# Altium schematic sheet Power Distribution.SchDoc
size A4; SheetNumber: 3; SheetTotal: 6
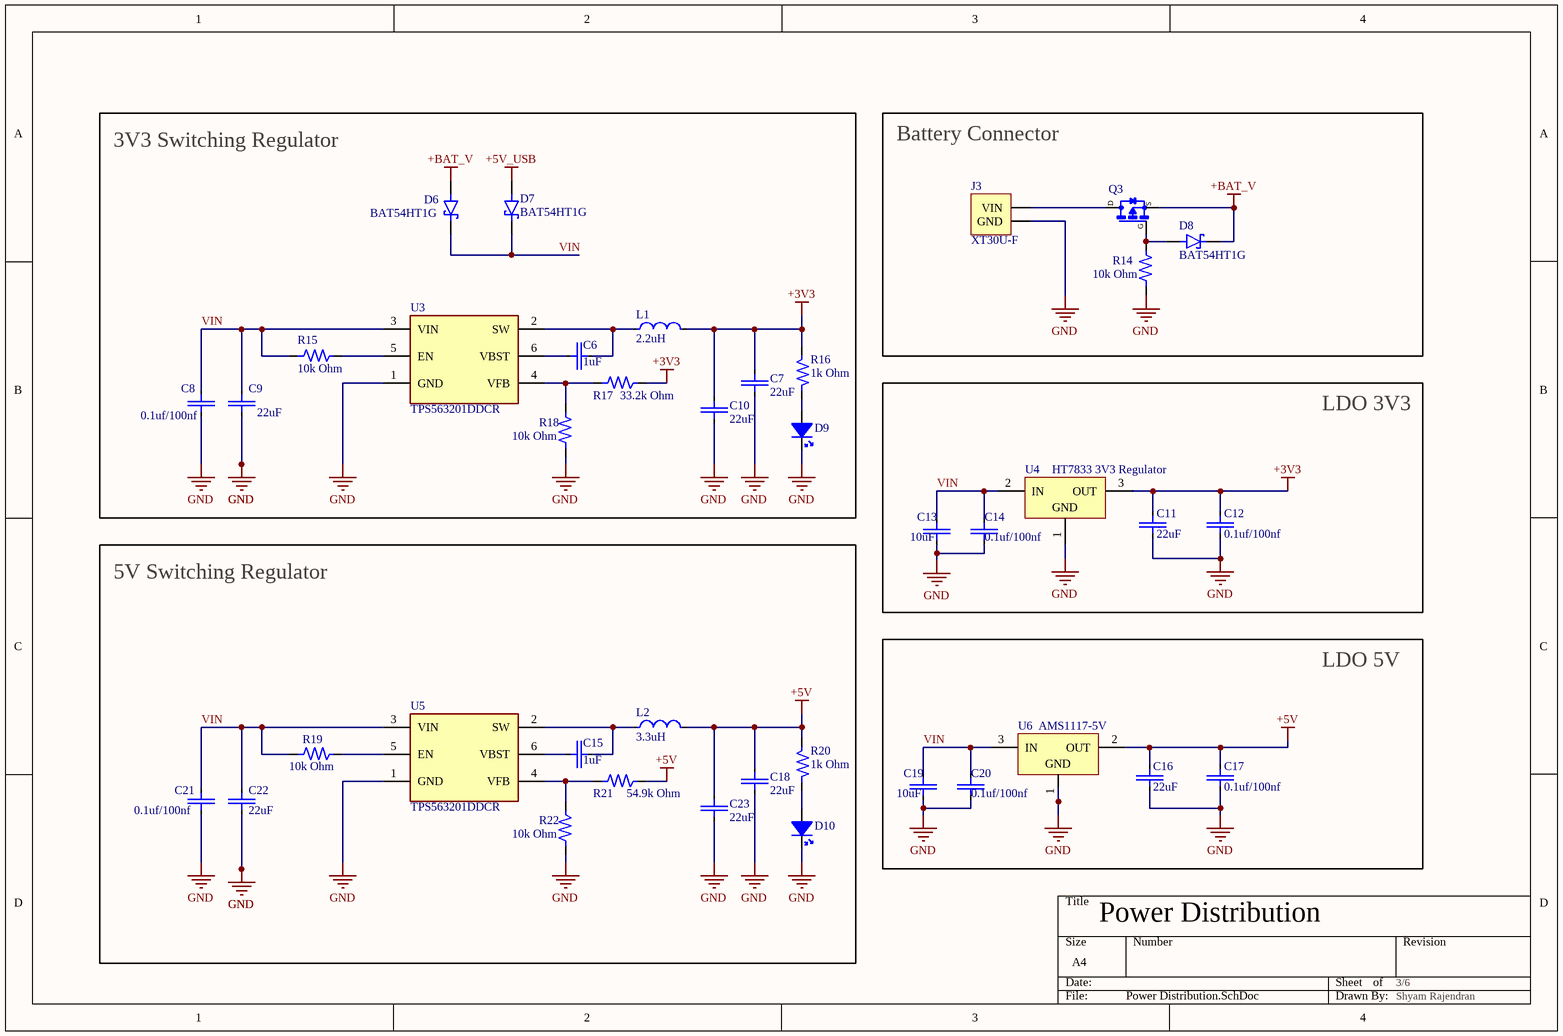
[diagram p0: Power Distribution.SchDoc]

## Parts
C6  1uF  [10uf Capacitor]
C7  22uF  [10uf Capacitor]
C8  0.1uf/100nf  [0.1uF Capacitor]
C9  22uF  [10uf Capacitor]
C10  22uF  [10uf Capacitor]
C11  22uF  [10uf Capacitor]
C12  0.1uf/100nf  [0.1uF Capacitor]
C13  10uF  [10uf Capacitor]
C14  0.1uf/100nf  [0.1uF Capacitor]
C15  1uF  [10uf Capacitor]
C16  22uF  [10uf Capacitor]
C17  0.1uf/100nf  [0.1uF Capacitor]
C18  22uF  [10uf Capacitor]
C19  10uF  [10uf Capacitor]
C20  0.1uf/100nf  [0.1uF Capacitor]
C21  0.1uf/100nf  [0.1uF Capacitor]
C22  22uF  [10uf Capacitor]
C23  22uF  [10uf Capacitor]
D6  BAT54HT1G  [SOD2513X110N]
D7  BAT54HT1G  [SOD2513X110N]
D8  BAT54HT1G  [SOD2513X110N]
D9  RED, 0805  [led red]  (value not drawn)
D10  RED, 0805  [led red]  (value not drawn)
J3  XT30U-F  [XT30UPB-F]
L1  2.2uH  [SWPA4030S]
L2  3.3uH  [SWPA5020]
Q3  SL2P10A  [P Mosfet SL2P10A]  (value not drawn)
R14  10k Ohm  [RESC2013X60X35ML10T20]
R15  10k Ohm  [RESC2013X60X35ML10T20]
R16  1k Ohm  [1k 0805 Resistor]
R17  33.2k Ohm  [1k 0805 Resistor]
R18  10k Ohm  [RESC2013X60X35ML10T20]
R19  10k Ohm  [RESC2013X60X35ML10T20]
R20  1k Ohm  [1k 0805 Resistor]
R21  54.9k Ohm  [1k 0805 Resistor]
R22  10k Ohm  [RESC2013X60X35ML10T20]
U3  TPS563201DDCR  [TPS563201DDCR]
U4  HT7833 3V3 Regulator  [HT7833]
U5  TPS563201DDCR  [TPS563201DDCR]
U6  AMS1117-5V  [AMS1117, 5V]

## Blocks framed on the sheet
3V3 Switching Regulator: C6-C10 D6 D7 D9 L1 R15-R18 U3
Battery Connector: D8 J3 Q3 R14
LDO 3V3: C11-C14 U4
5V Switching Regulator: C15 C18 C21-C23 D10 L2 R19-R22 U5
LDO 5V: C16 C17 C19 C20 U6

## Nets
+3V3: C7.2 C10.2 C11.2 C12.2 L1.2 R16.2 R17.2 U4.3(OUT)
+5V: C16.2 C17.2 C18.2 C23.2 L2.2 R20.2 R21.2 U6.2(OUT)
+5V_USB: D7.A
+BAT_V: D6.A D8.C(K) Q3.S
GND: C7.1 C8.1 C9.1 C10.1 C11.1 C12.1 C13.1 C14.1 C16.1 C17.1 C18.1 C19.1 C20.1 C21.1 C22.1 C23.1 D9.C D10.C J3.GND R14.1 R18.1 R22.1 U3.1(GND) U4.1(GND) U5.1(GND) U6.1(GND)
VIN: C8.2 C9.2 C13.2 C14.2 C19.2 C20.2 C21.2 C22.2 D6.C(K) D7.C(K) R15.1 R19.1 U3.3(VIN) U4.2(IN) U5.3(VIN) U6.3(IN)
NetC6_1: C6.1 U3.6(VBST)
NetC6_2: C6.2 L1.1 U3.2(SW)
NetC15_1: C15.1 U5.6(VBST)
NetC15_2: C15.2 L2.1 U5.2(SW)
NetD8_A: D8.A Q3.G R14.2
NetD9_A: D9.A R16.1
NetD10_A: D10.A R20.1
NetJ3_VIN: J3.VIN Q3.D
NetR15_2: R15.2 U3.5(EN)
NetR17_1: R17.1 R18.2 U3.4(VFB)
NetR19_2: R19.2 U5.5(EN)
NetR21_1: R21.1 R22.2 U5.4(VFB)

## Notes on the sheet
- Power Distribution <BMP280>
- 3/6 <BMP280>
- Shyam Rajendran <BMP280>

## Library data of the parts
C6 C15 = CC0805KKX7R6BB105: 1uF, Ceramic Capacitor, Multilayer, Ceramic, 10V, 10% +Tol, 10% -Tol, X7R, 15% TC,Surface Mount, 0805; Manufacturer: Yageo; Multilayer: Yes; Supplier: Future Electronics; Supplier Part Number: 2015429; Manufacturer Part Number: CC0805KKX7R6BB105; RoHS: Yes; Category: Ceramic Capacitors; Stock: 114000; Pricing: 3000=0.0123, 9000=0.012, 30000=0.0117, 60000=0.0116, 120000=0.0112 (USD); Mounting Technology: Surface Mount; Pins: 2; Dielectric Material: Ceramic; Package Shape: Rectangular; Case/Package: 0805; Terminal Finish: Nickel; Min Operating Temperature: -55°C; Max Operating Temperature: 125°C; JESD-609 Code: e3; Value: 1uF; Capacitor Type: Ceramic; Tolerance  (fill in as +-): 10%; Packaging: Tape and Reel; Tolerance (fill in as +-): 10%; Rated DC Voltage (URdc): 10V; Temperature Characteristics Code: X7R; Termination: Wraparound; Package Style: SMTMeter; Length: 2mm; Width: 1.25mm; Height: 1.25mm; Reach SVHC Compliant: Yes; RoHS Compliant: Yes; ComponentLink1URL: https://datasheet.ciiva.com:443/pdfs/VipMasterIC/IC/YAGO/YAGO-S-A0003557223/YAGO-S-A0003557223-1.pdf?src-supplier=IHS+Markit; ComponentLink1Description: https://datasheet.ciiva.com:443/pdfs/VipMasterIC/IC/YAGO/YAGO-S-A0003557223/YAGO-S-A0003557223-1.pdf?src-supplier=IHS+Markit
C7 C9-C11 C16 C18 C22 C23 = 22uF Capacitor: CL21A226KOQNNNE-Samsang-16V 22uF X5R ±10% 0805 Multilayer Ceramic Capacitors MLCC – SMD/SMT ROHS
C8 C12 C14 C17 C20 C21 = CC0805KRX7R9BB104: 0.1 uF, Multilayer Ceramic Capacitor, 50 V, ï¿½ 10%, X7R, 0805 [2012 Metric]; Manufacturer: Yageo; Value: 100nF; Voltage Rating: 50V; Insulation Resistance: 100GR; Supplier: Future Electronics; Supplier Part Number: 2986263; Manufacturer Part Number: CC0805KRX7R9BB104; RoHS: Yes; Category: Ceramic Capacitors; Stock: 2884000; Pricing: 4000=0.009, 12000=0.0088, 40000=0.0085, 80000=0.0083, 160000=0.008 (USD); Mounting Technology: Surface Mount; Case/Package: 0805; Pins: 2; Case Code (Metric): 2012; Case Code (Imperial): 0805; Material: Ceramic; Min Operating Temperature: -55°C; Max Operating Temperature: 125°C; Packaging: Tape and Reel; Tolerance: 10%; Dielectric: X7R; Series: CC; Package Quantity: 4000; Voltage: 50V; Termination: SMD/SMT; Length: 2mm; Height: 0.85mm; Depth: 1.25mm; Radiation Hardening: No; RoHS Compliant: Yes; Lead Free: 5697LeadFree; Reach SVHC Compliant: No; Halogen Free: 5694HalogenFree
C13 C19 = GRM21BR61E106KA73L: 10uF, Multilayer Ceramic Capacitor, 25 V, ï¿½ 10%, X5R, 0805 [2012 Metric]; Manufacturer: Murata; Voltage Rating: 25V; Supplier: Mouser; Supplier Part Number: 81-GRM21BR61E106KA3L; Manufacturer Part Number: GRM21BR61E106KA73L; RoHS: Yes; Category: Ceramic Capacitors; Stock: 165824; Pricing: 1=0.13, 10=0.038, 50=0.038, 100=0.035, 1000=0.035, 10000=0.027 (USD); Mounting Technology: Surface Mount; Case/Package: 0805; Case Code (Metric): 2012; Case Code (Imperial): 0805; Material: Ceramic; Min Operating Temperature: -55°C; Max Operating Temperature: 85°C; Package Quantity: 1; Value: 10uF; Tolerance: 10%; Packaging: Tape and Reel; Voltage Rating (DC): 25V; Dielectric: X5R; Termination: SMD/SMT; Series: GRM; Voltage: 25V; Construction: Flat; Length: 2mm; Width: 0.049inch; Height: 1.25mm; Thickness: 0.053inch; Depth: 1.25mm; RoHS Compliant: Yes; Lead Free: 5697LeadFree; Reach SVHC Compliant: No; ComponentLink1URL: https://datasheet.ciiva.com/14116/grmseries-highdielectrictype-eng-14116376.pdf?src-supplier=Distrelec; ComponentLink1Description: https://datasheet.ciiva.com/14116/grmseries-highdielectrictype-eng-14116376.pdf?src-supplier=Distrelec; ComponentLink2URL: https://datasheet.ciiva.com/7719/1747469-7719093.pdf?src-supplier=Element14; ComponentLink2Description: https://datasheet.ciiva.com/7719/1747469-7719093.pdf?src-supplier=Element14
D6-D8 = BAT54HT1G: BAT54HT1G-ONSEMI-BAT54HT1G-Small Signal Schottky Diode, Single, 30 V, 200 mA, 800 mV, 600 mA, 150 °C; MF: Infineon Technologies; MP: BAS3010A03WE6327HTSA1; Price: None; Mouser-Purchase-URL: https://snapeda.com/shop?store=Mouser&id=447647; Value: *; Arrow_Electronics-Purchase-URL: https://snapeda.com/shop?store=Arrow+Electronics&id=447647; Package: SOD-323 Infineon; DigiKey-Purchase-URL: https://snapeda.com/shop?store=DigiKey&id=447647; SnapEDA_Link: https://www.snapeda.com/parts/BAS3010A03WE6327HTSA1/Infineon%20Technologies/view-part/447647/?ref=snap; Availability: Unavailable
D9 D10 = LED RED
J3 = XT30 Connector
L1 = 2.2uH Inductor: SWPA4030S2R2MT-Sunlord-2.2uH 2.95A 20% 39mOhm Shielded Wirewound Power Inductor SMD; Test Frequency: 1MHz; Max DC Current: 600mA; Core Material: Ferrite; DC Resistance (DCR): 340mR; Self Resonant Frequency: 50MHz; RoHS Compliant: Yes; Height: 0.5mm; Inductance: 2.2uH; Mount: Surface Mount; REACH SVHC: No SVHC; Width: 0.049inch; Military Standard: Not; Max Operating Temperature: 125°C; Lead Free: Lead Free; Tolerance: 20%; Series: LQM21PN_CO; Case Code (Imperial): 0805; Case Code (Metric): 2012; Length: 2mm; Package Quantity: 4000; Radiation Hardening: No; Termination: SMD/SMT; Inductance Tolerance: 20%; Rated Current-Max: 600mA; Current Rating: 600mA; Min Operating Temperature: -55°C; Case/Package: 0805; Height - Seated (Max): 0.022inch; Depth: 1.45mm; Packaging: Tape and Reel; Shielding: Shielded; DC Current: 600mA
L2 = 3.3uH Inductor: SWPA5020S3R3MT-Sunlord-3.3uH 2.5A 20% 56mOhm Shielded Wirewound Power Inductor SMD; Test Frequency: 1MHz; Inductance: 2.2uH; Max DC Current: 600mA; Core Material: Ferrite; DC Resistance (DCR): 340mR; Self Resonant Frequency: 50MHz; RoHS Compliant: Yes; Height: 0.5mm; Mount: Surface Mount; REACH SVHC: No SVHC; Width: 0.049inch; Military Standard: Not; Max Operating Temperature: 125°C; Lead Free: Lead Free; Tolerance: 20%; Series: LQM21PN_CO; Case Code (Imperial): 0805; Case Code (Metric): 2012; Length: 2mm; Package Quantity: 4000; Radiation Hardening: No; Termination: SMD/SMT; Inductance Tolerance: 20%; Rated Current-Max: 600mA; Current Rating: 600mA; Min Operating Temperature: -55°C; Case/Package: 0805; Height - Seated (Max): 0.022inch; Depth: 1.45mm; Packaging: Tape and Reel; Shielding: Shielded; DC Current: 600mA
Q3 = SL2P10A: MOSFET, Power,P-Ch,VDSS -20V,RDS(ON) 0.031Ohm,ID -3.7A,TO-236 (SOT-23),PD 0.75W | Siliconix / Vishay SI2323DS-T1-E3; MF: Vishay Siliconix; SnapEDA_Link: https://www.snapeda.com/parts/SI2323DS-T1-E3/Vishay/view-part/?ref=snap; Package: SOT-23-3 Vishay Siliconix; Value: *; MP: SI2323DS-T1-E3; Check_prices: https://www.snapeda.com/parts/SI2323DS-T1-E3/Vishay/view-part/?ref=eda
R14 R15 R18 R19 R22 = RC0805FR-0710KL: 10 kOhm, SMD Chip Resistor, ï¿½ 1%, 125 mW, 0805 [2012 Metric], Thick Film, General Purpose; Manufacturer: Yageo; Value: 10kR; Power Rating: 125mW; Voltage Rating: 150V; Temperature Coefficient: 100ppm/°C; Supplier: Future Electronics; Supplier Part Number: 3310877; Manufacturer Part Number: RC0805FR-0710KL; RoHS: Yes; Category: Chip SMD Resistors; Stock: 15945000; Pricing: 5000=0.0021, 20000=0.002, 100000=0.0019, 200000=0.0018, 625000=0.0017 (USD); Case/Package: 0805; Case Code (Imperial): 0805; Case Code (Metric): 2012; Min Operating Temperature: -55°C; Max Operating Temperature: 155°C; Packaging: Tape and Reel; Tolerance: 1%; Termination: SMD/SMT; Number of Terminations: 2; Max Power Dissipation: 125mW; Features: Moisture Resistant; Series: RC; Resistor Type: Thick Film; Construction: Rectangular; Resistance Tolerance: 1%; Package Quantity: 1; Technology: THICK FILM; Voltage Rating (AC): 150V; Length: 0.079inch; Width: 0.049inch; Height: 0.024inch; Depth: 1.25mm; Lead Free: Lead Free; RoHS Compliant: Yes; Military Standard: Not; Reach SVHC Compliant: Unknown; ComponentLink1URL: https://datasheet.ciiva.com/11808/0900766b8106beab-11808151.pdf?src-supplier=Rs; ComponentLink1Description: https://datasheet.ciiva.com/11808/0900766b8106beab-11808151.pdf?src-supplier=Rs; ComponentLink2URL: https://datasheet.ciiva.com/46447/444164-46447563.pdf?src-supplier=Element14; ComponentLink2Description: https://datasheet.ciiva.com/46447/444164-46447563.pdf?src-supplier=Element14; ComponentLink3URL: https://datasheet.ciiva.com/2456/pyu-r-int-thick-7-2456973.pdf?src-supplier=Digikey; ComponentLink3Description: https://datasheet.ciiva.com/2456/pyu-r-int-thick-7-2456973.pdf?src-supplier=Digikey; ComponentLink4URL: https://datasheet.ciiva.com/2456/pyu-r-int-thick-7-2456974.pdf?src-supplier=Digikey; ComponentLink4Description: https://datasheet.ciiva.com/2456/pyu-r-int-thick-7-2456974.pdf?src-supplier=Digikey; ComponentLink5URL: https://datasheet.ciiva.com/2456/pyu-r-int-thick-7-2456972.pdf?src-supplier=Digikey; ComponentLink5Description: https://datasheet.ciiva.com/2456/pyu-r-int-thick-7-2456972.pdf?src-supplier=Digikey; ComponentLink6URL: https://datasheet.ciiva.com/12669/rc0805-12669688.pdf?src-supplier=Mouser; ComponentLink6Description: https://datasheet.ciiva.com/12669/rc0805-12669688.pdf?src-supplier=Mouser; ComponentLink7URL: https://datasheet.ciiva.com/16747/rc0805-16747087.pdf?src-supplier=Future+Electronics; ComponentLink7Description: https://datasheet.ciiva.com/16747/rc0805-16747087.pdf?src-supplier=Future+Electronics
R16 R20 = RC0805FR-071KL: 1k Ohm, 0805, SMD Chip Resistor , ï¿½ 1%, 125 mW,[2012 Metric], Thick Film, General Purpose; Manufacturer: Yageo; Value: 1kR; Power Rating: 125mW; Voltage Rating: 150V; Temperature Coefficient: 100ppm/°C; Supplier: Future Electronics; Supplier Part Number: 8126013; Manufacturer Part Number: RC0805FR-071KL; RoHS: Yes; Category: Chip SMD Resistors; Stock: 5450000; Pricing: 5000=0.0021, 20000=0.002, 100000=0.0019, 200000=0.0018, 625000=0.0017 (USD); Case/Package: 0805; Pins: 2; Case Code (Metric): 2012; Case Code (Imperial): 0805; Min Operating Temperature: -55°C; Max Operating Temperature: 155°C; Tolerance: 1%; Packaging: Tape and Reel; Voltage Rating (DC): 150V; Resistor Type: Thick Film; Series: RC; Number of Terminations: 2; Termination: SMD/SMT; Max Power Dissipation: 125mW; Resistance Tolerance: 1%; Package Quantity: 1; Features: Moisture Resistant; Construction: Rectangular; Voltage Rating (AC): 150V; Length: 0.079inch; Width: 0.049inch; Height: 0.024inch; Depth: 1.25mm; RoHS Compliant: Yes; Reach SVHC Compliant: No; Military Standard: Not; Lead Free: Lead Free
R17 = 33.2k Ohm: 0805
R21 = 54.9k Ohm: 0805
U3 U5 = TPS563201DDCR: 4.5 V to 17 V input, 3 A output, synchronous step-down converter in Eco-mode; MF: Texas Instruments; SnapEDA_Link: https://www.snapeda.com/parts/TPS563201DDCR/Texas+Instruments/view-part/?ref=snap; Package: SOT-23-THN-6 Texas Instruments; Value: *; MP: TPS563201DDCR; Check_prices: https://www.snapeda.com/parts/TPS563201DDCR/Texas+Instruments/view-part/?ref=eda
U4 = HT7833: 3V3 Voltage Regulator
U6 = AMS1117-5V: SOT89